# Altium schematic sheet Raven.SchDoc
size Letter; Organization: Altium Limited; Address1: L3, 12a Rodborough Rd; Address2: Frenchs Forest; Address3: NSW; Address4: Australia 2086
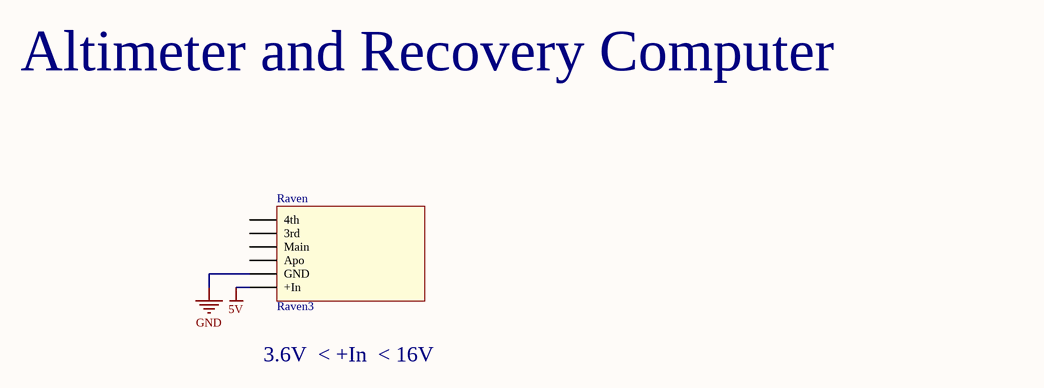
[diagram p0: Raven.SchDoc]

## Parts
Raven  Raven3  [Raven3]

## Nets
5V: Raven.6(+In)
GND: Raven.5(GND)

Not connected (* = marked no-connect by the designer): Raven 1(4th) 2(3rd) 3(Main) 4(Apo)

## Notes on the sheet
- Altimeter and Recovery Computer
- 3.6V  < +In  < 16V
- Title
- Size:
- Date:
- Letter
- Number:
- Time:
- Revision:
- Sheet
- of
- File:

## Library data of the parts
Raven = Raven3: Altimeter